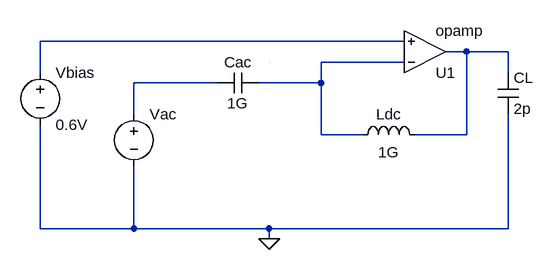
[diagram p0: schematic ac_setup.asc]
ac_setup.asc, the LTspice schematic file:
Version 4
SHEET 1 880 680
WIRE 208 -32 -352 -32
WIRE 304 -16 272 -16
WIRE 368 -16 304 -16
WIRE 208 0 80 0
WIRE -352 16 -352 -32
WIRE 368 16 368 -16
WIRE -80 32 -208 32
WIRE 80 32 80 0
WIRE 80 32 -16 32
WIRE -208 80 -208 32
WIRE 80 112 80 32
WIRE 144 112 80 112
WIRE 304 112 304 -16
WIRE 304 112 224 112
WIRE -352 256 -352 96
WIRE -208 256 -208 160
WIRE -208 256 -352 256
WIRE 0 256 -208 256
WIRE 368 256 368 80
WIRE 368 256 0 256
WIRE 0 272 0 256
WIRE 0 0 0 0
FLAG 0 272 0
SYMBOL Opamps\\opamp 240 48 M180
SYMATTR InstName U1
SYMBOL cap 352 16 R0
SYMATTR InstName CL
SYMATTR Value 2p
SYMBOL voltage -208 64 R0
SYMATTR InstName Vac
SYMATTR Value ""
SYMBOL voltage -352 0 R0
SYMATTR InstName Vbias
SYMATTR Value 0.6V
SYMBOL ind 128 128 R270
WINDOW 0 32 56 VTop 2
WINDOW 3 5 56 VBottom 2
SYMATTR InstName Ldc
SYMATTR Value 1G
SYMBOL cap -16 16 R90
WINDOW 0 0 32 VBottom 2
WINDOW 3 32 32 VTop 2
SYMATTR InstName Cac
SYMATTR Value 1G

The netlist it stands for:
* ac_setup.asc
XU1 N003 N001 N002 opamp Aol=100K GBW=10Meg  ; pins invin noninvin out
CL N002 0 2p
Vac N004 0
Vbias N001 0 0.6V
Ldc N003 N002 1G
Cac N003 N004 1G
.backanno
.end